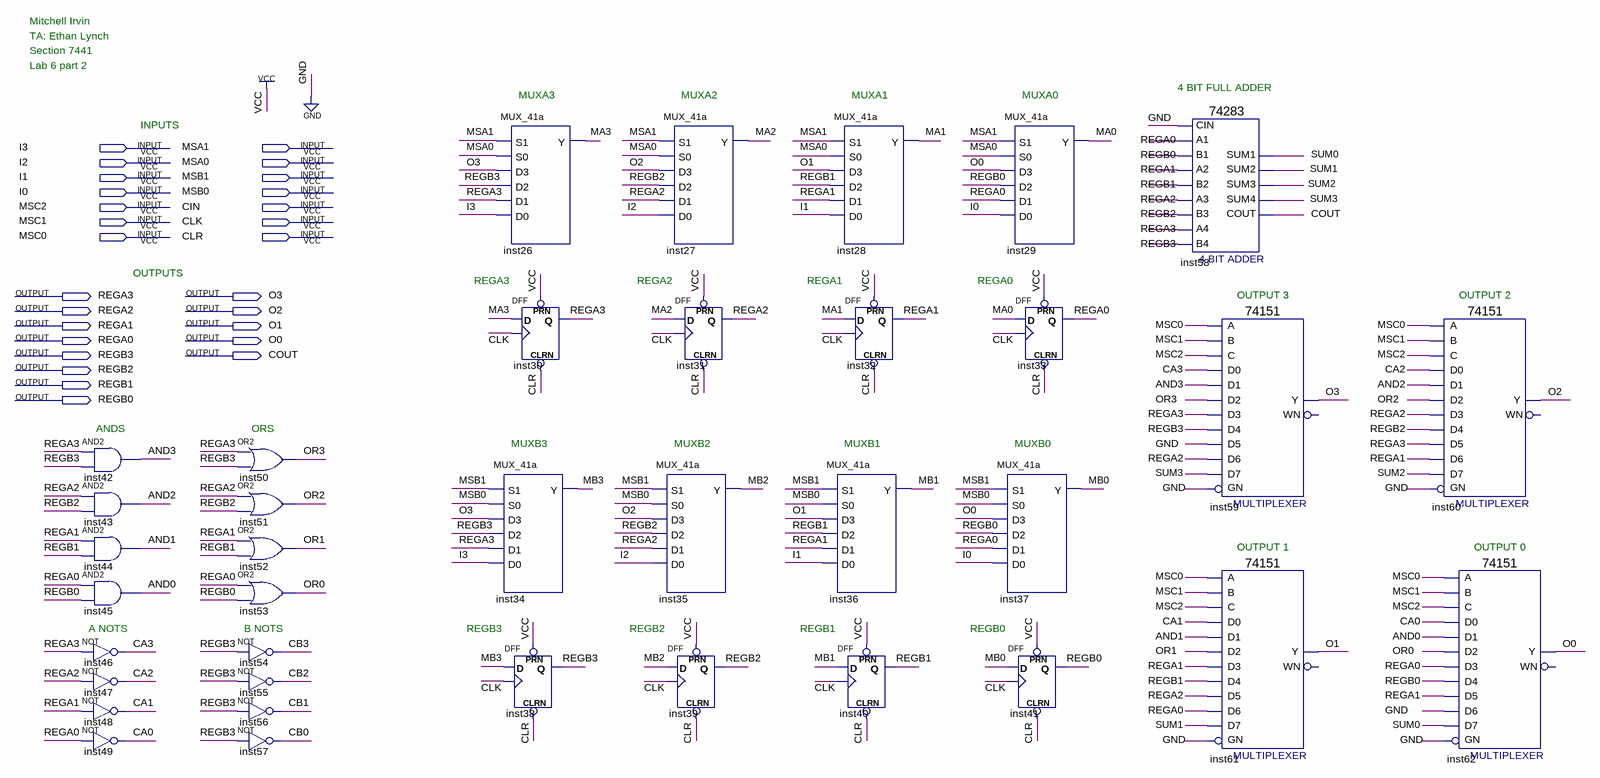
[diagram p0: schematic sheet]
// Quartus schematic Part2.bdf as structural Verilog: 37 symbols, 27 pins
module Part2 (
  input  I3,
  input  MSA1,
  input  I2,
  input  MSA0,
  input  I1,
  input  MSB1,
  input  I0,
  input  MSB0,
  input  MSC2,
  input  CIN,
  input  MSC1,
  input  CLK,
  input  MSC0,
  input  CLR,
  output REGA3,
  output O3,
  output REGA2,
  output O2,
  output REGA1,
  output O1,
  output REGA0,
  output O0,
  output REGB3,
  output COUT,
  output REGB2,
  output REGB1,
  output REGB0
);

  wire AND0, AND1, AND2, AND3, CA0, CA1, CA2, CA3, CB0, CB1, CB2, CB3, MA0, MA1, MA2, MA3, MB0, MB1, MB2,
       MB3, OR0, OR1, OR2, OR3, SUM0, SUM1, SUM2, SUM3;

  and inst42 (AND3, REGA3, REGB3);
  and inst43 (AND2, REGA2, REGB2);
  and inst44 (AND1, REGA1, REGB1);
  and inst45 (AND0, REGA0, REGB0);
  not inst46 (CA3, REGA3);
  not inst47 (CA2, REGA2);
  not inst48 (CA1, REGA1);
  not inst49 (CA0, REGA0);
  or inst50 (OR3, REGA3, REGB3);
  or inst51 (OR2, REGA2, REGB2);
  or inst52 (OR1, REGA1, REGB1);
  or inst53 (OR0, REGA0, REGB0);
  not inst54 (CB3, REGB3);
  not inst55 (CB2, REGB3);
  not inst56 (CB1, REGB3);
  not inst57 (CB0, REGB3);
  MUX_41a inst34 (.S1(MSB1), .S0(MSB0), .D3(O3), .D2(REGB3), .D1(REGA3), .D0(I3), .Y(MB3));
  MUX_41a inst26 (.S1(MSA1), .S0(MSA0), .D3(O3), .D2(REGB3), .D1(REGA3), .D0(I3), .Y(MA3));
  DFF inst30 (.CLRN(CLR), .CLK(CLK), .D(MA3), .PRN(1'b1), .Q(REGA3));
  DFF inst38 (.CLRN(CLR), .CLK(CLK), .D(MB3), .PRN(1'b1), .Q(REGB3));
  MUX_41a inst27 (.S1(MSA1), .S0(MSA0), .D3(O2), .D2(REGB2), .D1(REGA2), .D0(I2), .Y(MA2));
  MUX_41a inst35 (.S1(MSB1), .S0(MSB0), .D3(O2), .D2(REGB2), .D1(REGA2), .D0(I2), .Y(MB2));
  DFF inst39 (.CLRN(CLR), .CLK(CLK), .D(MB2), .PRN(1'b1), .Q(REGB2));
  DFF inst31 (.CLRN(CLR), .CLK(CLK), .D(MA2), .PRN(1'b1), .Q(REGA2));
  MUX_41a inst28 (.S1(MSA1), .S0(MSA0), .D3(O1), .D2(REGB1), .D1(REGA1), .D0(I1), .Y(MA1));
  DFF inst32 (.CLRN(CLR), .CLK(CLK), .D(MA1), .PRN(1'b1), .Q(REGA1));
  MUX_41a inst36 (.S1(MSB1), .S0(MSB0), .D3(O1), .D2(REGB1), .D1(REGA1), .D0(I1), .Y(MB1));
  DFF inst40 (.CLRN(CLR), .CLK(CLK), .D(MB1), .PRN(1'b1), .Q(REGB1));
  MUX_41a inst29 (.S1(MSA1), .S0(MSA0), .D3(O0), .D2(REGB0), .D1(REGA0), .D0(I0), .Y(MA0));
  DFF inst33 (.CLRN(CLR), .CLK(CLK), .D(MA0), .PRN(1'b1), .Q(REGA0));
  MUX_41a inst37 (.S1(MSB1), .S0(MSB0), .D3(O0), .D2(REGB0), .D1(REGA0), .D0(I0), .Y(MB0));
  DFF inst41 (.CLRN(CLR), .CLK(CLK), .D(MB0), .PRN(1'b1), .Q(REGB0));
  \74283  inst58 (
    .CIN(1'b0), .A1(REGA0), .A2(REGA1), .B2(REGB1), .A3(REGA2), .A4(REGA3), .B4(REGB3), .B1(REGB0),
    .B3(REGB2), .SUM4(SUM3), .COUT(COUT), .SUM1(SUM0), .SUM2(SUM1), .SUM3(SUM2));
  \74151  inst59 (
    .GN(1'b0), .C(MSC2), .B(MSC1), .A(MSC0), .D5(1'b0), .D0(CA3), .D1(AND3), .D4(REGB3), .D3(REGA3),
    .D2(OR3), .D6(REGA2), .D7(SUM3), .Y(O3));  // open: WN
  \74151  inst61 (
    .GN(1'b0), .C(MSC2), .B(MSC1), .A(MSC0), .D5(REGA2), .D0(CA1), .D1(AND1), .D4(REGB1), .D3(REGA1),
    .D2(OR1), .D6(REGA0), .D7(SUM1), .Y(O1));  // open: WN
  \74151  inst60 (
    .GN(1'b0), .C(MSC2), .B(MSC1), .A(MSC0), .D5(REGA3), .D0(CA2), .D1(AND2), .D4(REGB2), .D3(REGA2),
    .D2(OR2), .D6(REGA1), .D7(SUM2), .Y(O2));  // open: WN
  \74151  inst62 (
    .GN(1'b0), .C(MSC2), .B(MSC1), .A(MSC0), .D5(REGA1), .D0(CA0), .D1(AND0), .D4(REGB0), .D3(REGA0),
    .D2(OR0), .D6(1'b0), .D7(SUM0), .Y(O0));  // open: WN

  // Notes on the sheet:
  //   Mitchell Irvin
  //   TA: Ethan Lynch
  //   Section 7441
  //   Lab 6 part 2
  //   4 BIT FULL ADDER
  //   MUXA3
  //   MUXA2
  //   MUXA1
  //   MUXA0
  //   INPUTS
  //   OUTPUTS
  //   REGA3
  //   REGA2
  //   REGA1
  //   REGA0
  //   OUTPUT 3
  //   OUTPUT 2
  //   ANDS
  //   ORS
  //   MUXB3
  //   MUXB2
  //   MUXB1
  //   MUXB0
  //   OUTPUT 1
  //   OUTPUT 0
  //   A NOTS
  //   B NOTS
  //   REGB3
  //   REGB2
  //   REGB1
  //   REGB0
endmodule
